# Altium schematic sheet Korsze.SchDoc
size A4
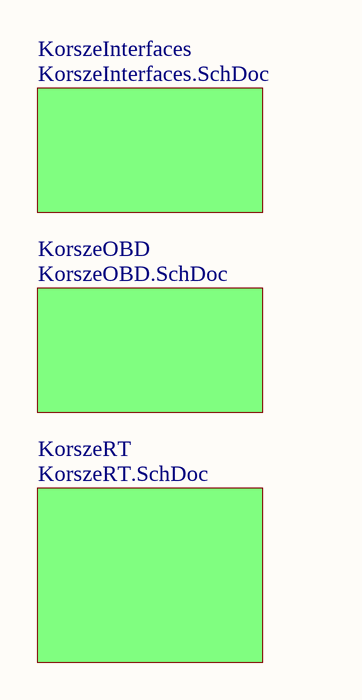
[diagram p0: Korsze.SchDoc]

## Sub-sheets
KorszeInterfaces = KorszeInterfaces.SchDoc: no entries
KorszeOBD = KorszeOBD.SchDoc: no entries
KorszeRT = KorszeRT.SchDoc: no entries